# EAGLE design Teensy36 CAN Bus (EAGLE 9.6.1)
COMPANY_NAME: PROJECTMX5; PROJECT: TEENSY 3.6 DUAL CAN ADAPTER; SCH_REV: A
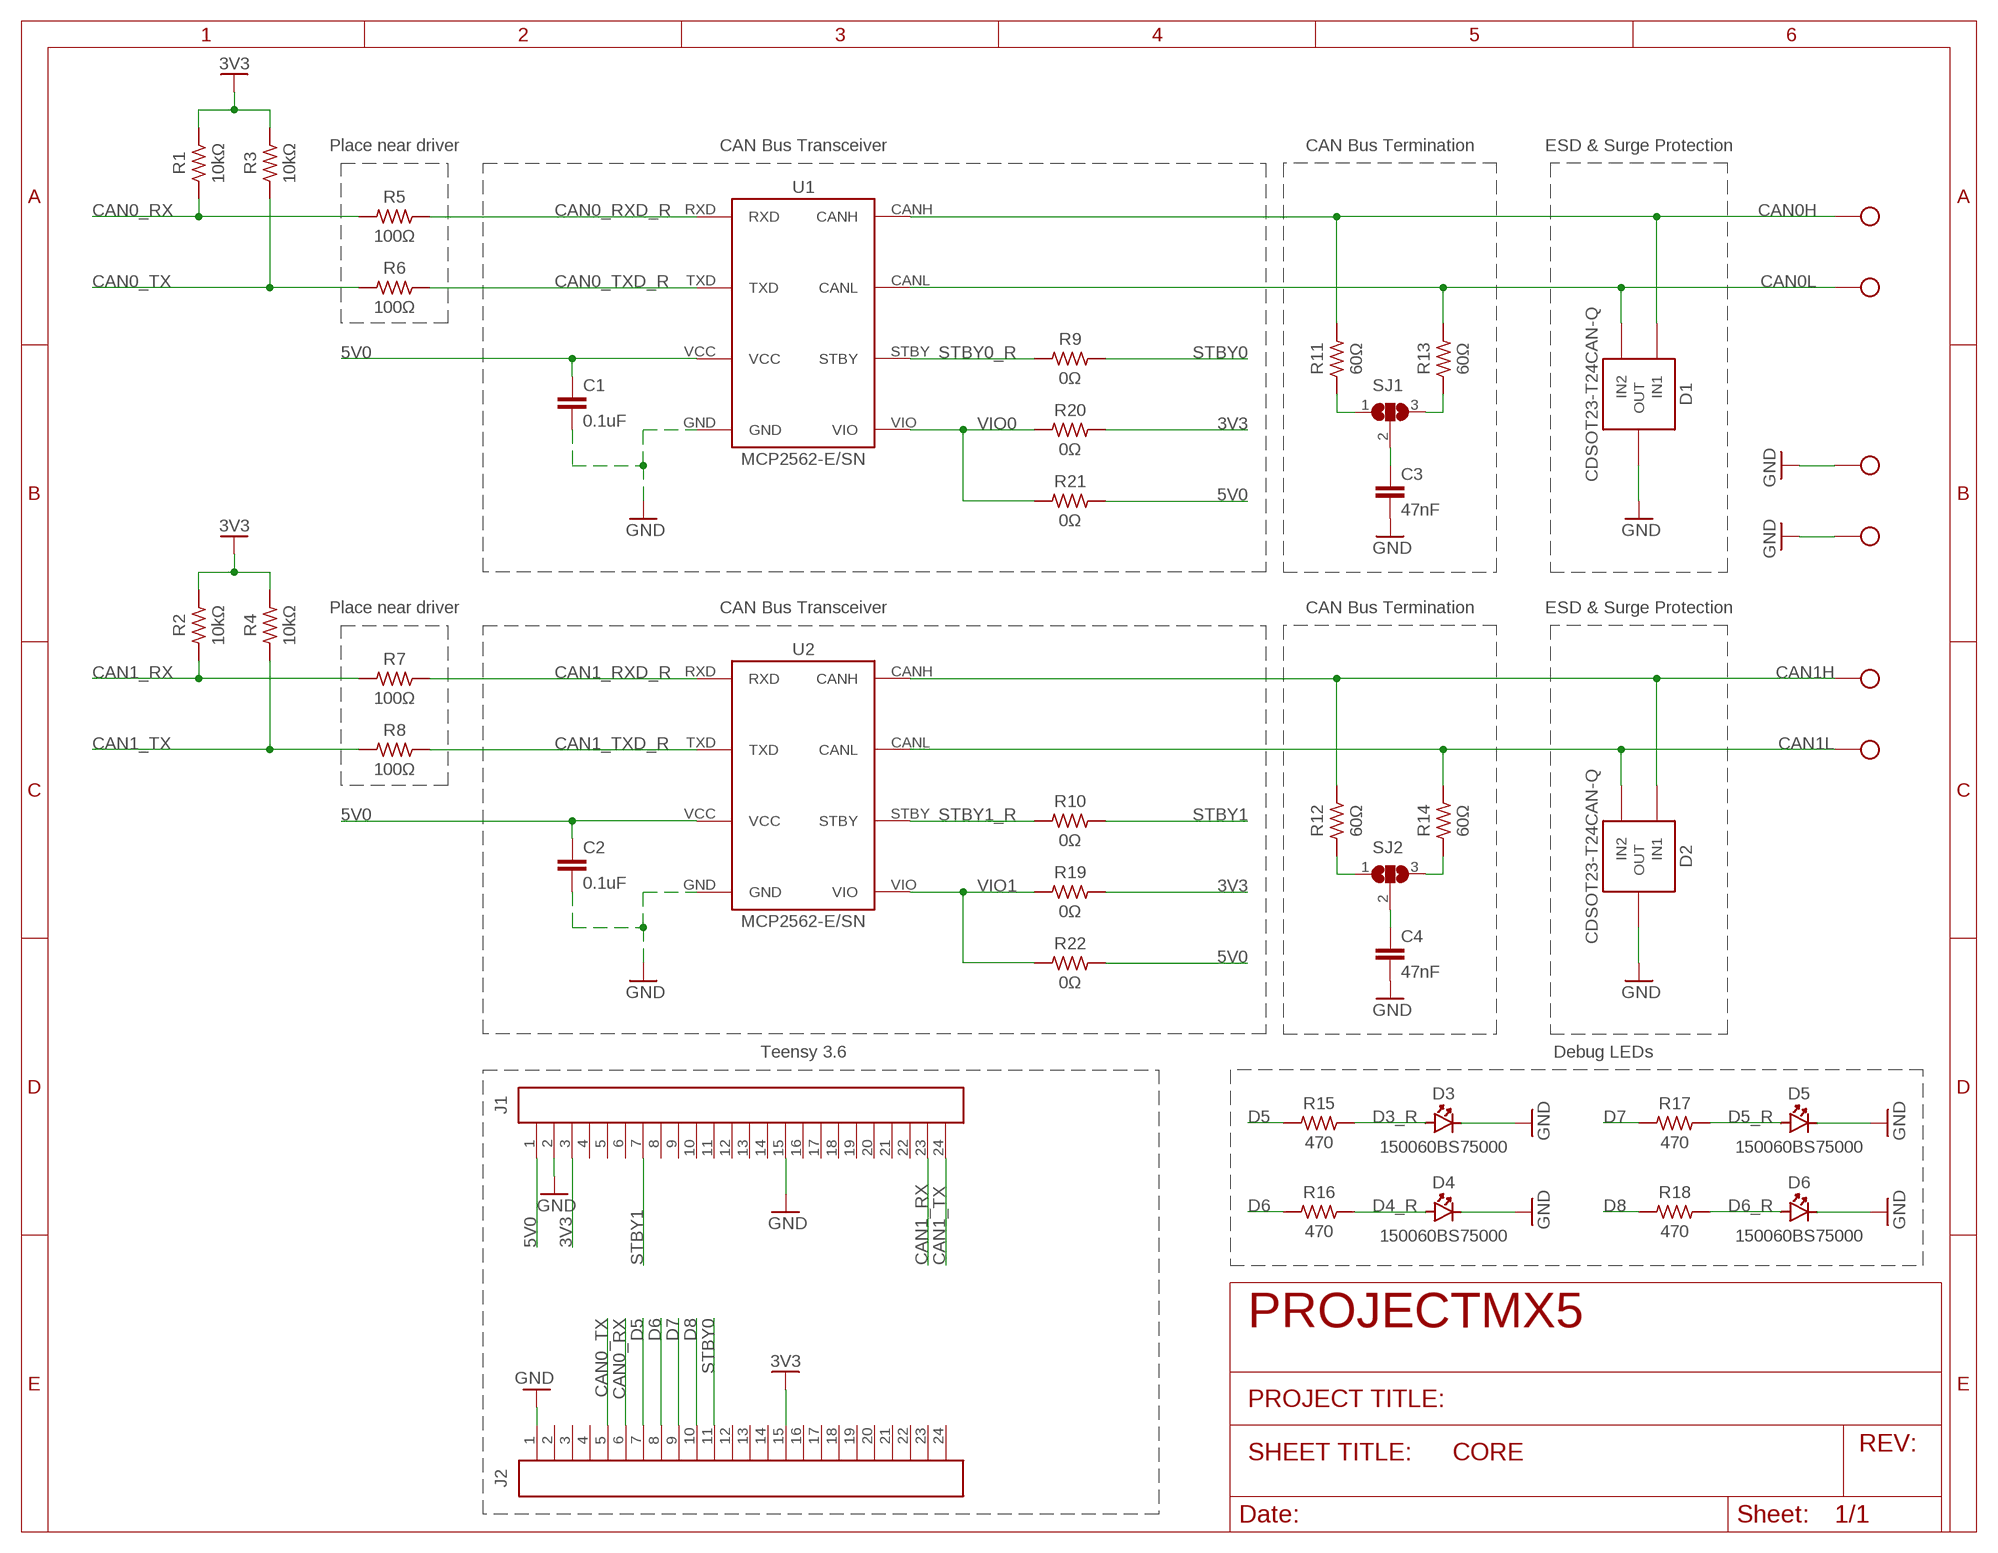
[diagram p0: schematic, sheet 1]

## Parts
C1  0.1uF  CAPACITOR0603  [CAP-0603]
C2  0.1uF  CAPACITOR0603  [CAP-0603]
C3  47nF  CAPACITOR0603  [CAP-0603]
C4  47nF  CAPACITOR0603  [CAP-0603]
D1  CDSOT23-T24CAN-Q  BOURNS_CDSOT23-T24CAN-Q  [BOURNS_CDSOT23-T24CAN-Q]
D2  CDSOT23-T24CAN-Q  BOURNS_CDSOT23-T24CAN-Q  [BOURNS_CDSOT23-T24CAN-Q]
D3  LED_BLUE_0603_WURTH  [WURTH_0603_LED]
D4  LED_BLUE_0603_WURTH  [WURTH_0603_LED]
D5  LED_BLUE_0603_WURTH  [WURTH_0603_LED]
D6  LED_BLUE_0603_WURTH  [WURTH_0603_LED]
J1  CONN_24PIN_VERT  [CONN_100MIL_24_PIN]
J2  CONN_24PIN_VERT  [CONN_100MIL_24_PIN]
J3  SOLDER_POINT  [SMD_PAD_100X200]
J4  SOLDER_POINT  [SMD_PAD_100X200]
J5  SOLDER_POINT  [SMD_PAD_100X200]
J6  SOLDER_POINT  [SMD_PAD_100X200]
J7  SOLDER_POINT  [SMD_PAD_100X200]
J8  SOLDER_POINT  [SMD_PAD_100X200]
R1  10kΩ  RESISTOR  [REST-0603]
R2  10kΩ  RESISTOR  [REST-0603]
R3  10kΩ  RESISTOR  [REST-0603]
R4  10kΩ  RESISTOR  [REST-0603]
R5  100Ω  RESISTOR  [REST-0603]
R6  100Ω  RESISTOR  [REST-0603]
R7  100Ω  RESISTOR  [REST-0603]
R8  100Ω  RESISTOR  [REST-0603]
R9  0Ω  RESISTOR  [REST-0603]
R10  0Ω  RESISTOR  [REST-0603]
R11  60Ω  RESISTOR  [REST-0603]
R12  60Ω  RESISTOR  [REST-0603]
R13  60Ω  RESISTOR  [REST-0603]
R14  60Ω  RESISTOR  [REST-0603]
R15  470  470OHM-0603-1%-1/10W  [REST-0603]
R16  470  470OHM-0603-1%-1/10W  [REST-0603]
R17  470  470OHM-0603-1%-1/10W  [REST-0603]
R18  470  470OHM-0603-1%-1/10W  [REST-0603]
R19  0Ω  RESISTOR  [REST-0603]
R20  0Ω  RESISTOR  [REST-0603]
R21  0Ω  RESISTOR  [REST-0603]
R22  0Ω  RESISTOR  [REST-0603]
SJ1  SJ2W  [SJ_2]
SJ2  SJ2W  [SJ_2]
U1  SN65HVD230DR  MICROCHIP_MCP2562-E/SN  [MICROCHIP_MCP2562]
U2  SN65HVD230DR  MICROCHIP_MCP2562-E/SN  [MICROCHIP_MCP2562]

## Nets
3V3: J1.3 J2.15 R1.2 R2.2 R3.2 R4.2 R19.2 R20.2
5V0: C1.1 C2.1 J1.1 R21.2 R22.2 U1.VCC U2.VCC
CAN0_CM: R13.1 SJ1.3
CAN0_RX: J2.6 R1.1 R5.1
CAN0_RXD_R: R5.2 U1.RXD
CAN0_TX: J2.5 R3.1 R6.1
CAN0_TXD_R: R6.2 U1.TXD
CAN0H: D1.IN2(IN1) J5.P$1(IN) R11.2 U1.CANH
CAN0L: D1.IN1(IN2) J6.P$1(IN) R13.2 U1.CANL
CAN1_RX: J1.23 R2.1 R7.1
CAN1_RXD_R: R7.2 U2.RXD
CAN1_TX: J1.24 R4.1 R8.1
CAN1_TXD_R: R8.2 U2.TXD
CAN1H: D2.IN2(IN1) J3.P$1(IN) R12.2 U2.CANH
CAN1L: D2.IN1(IN2) J4.P$1(IN) R14.2 U2.CANL
D3_R: D3.A R15.2
D4_R: D4.A R16.2
D5: J2.7 R15.1
D5_R: D5.A R17.2
D6: J2.8 R16.1
D6_R: D6.A R18.2
D7: J2.9 R17.1
D8: J2.10 R18.1
GND: C1.2 C2.2 C3.2 C4.2 D1.COMMON(OUT) D2.COMMON(OUT) D3.C D4.C D5.C D6.C J1.2 J1.15 J2.1 J7.P$1(IN) J8.P$1(IN) U1.GND U2.GND
N$1: R11.1 SJ1.1
N$2: C3.1 SJ1.2
N$3: R12.1 SJ2.1
N$4: R14.1 SJ2.3
N$5: C4.1 SJ2.2
STBY0: J2.11 R9.2
STBY0_R: R9.1 U1.STBY
STBY1: J1.7 R10.2
STBY1_R: R10.1 U2.STBY
VIO0: R20.1 R21.1 U1.VIO
VIO1: R19.1 R22.1 U2.VIO
Unconnected: J1.4 J1.5 J1.6 J1.8 J1.9 J1.10 J1.11 J1.12 J1.13 J1.14 J1.16 J1.17 J1.18 J1.19 J1.20 J1.21 J1.22 J2.2 J2.3 J2.4 J2.12 J2.13 J2.14 J2.16 J2.17 J2.18 J2.19 J2.20 J2.21 J2.22 J2.23 J2.24

## Notes on the sheet
- Place near driver | CAN Bus Transceiver | CAN Bus Termination | ESD & Surge Protection
- Place near driver | CAN Bus Transceiver | CAN Bus Termination | ESD & Surge Protection
- Teensy 3.6 | Debug LEDs

## Library data of the parts
C1-C4 = AlphaLibrary:CAPACITOR
D1 D2 = AlphaLibrary:BOURNS_CDSOT23-T24CAN-Q: ESD and surge protection for CAN transceivers
D3-D6 = AlphaLibrary:LED_BLUE_0603_WURTH: STANDARD LED, BLUE, 0603; MFG: WURTH ELEKTRONIK; MNT: SMD; PINS: 2; PKG: 0603; PN: 150060BS75000
J1 J2 = AlphaLibrary:CONN_24PIN_VERT: 24 Pin Header, 100mil
J3-J8 = KaiserEngineering:SOLDER_POINT
R1-R14 R19-R22 = AlphaLibrary:RESISTOR: Resistor
R15-R18 = resistors:470OHM: RESISTOR; MFG: PANASONIC; MNT: SMD; PINS: 2; PKG: 0603; PN: ERJ-3EKF4700V
SJ1 SJ2 = jumper:SJ2W: SMD solder JUMPER
U1 U2 = AlphaLibrary:MICROCHIP_MCP2562-E/SN: 3.3V CAN Bus TRANSCEIVER; MFG: MICROCHIP; MNT: SMD; PINS: 8; PKG: SOIC-8; PN: MCP2562-E/SN

## Board
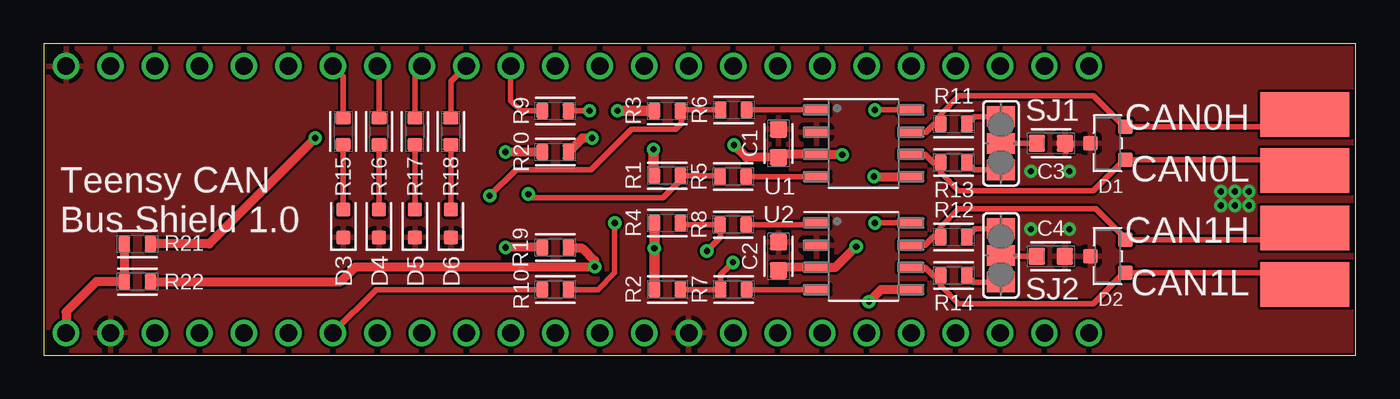
[diagram p1: board, top side]
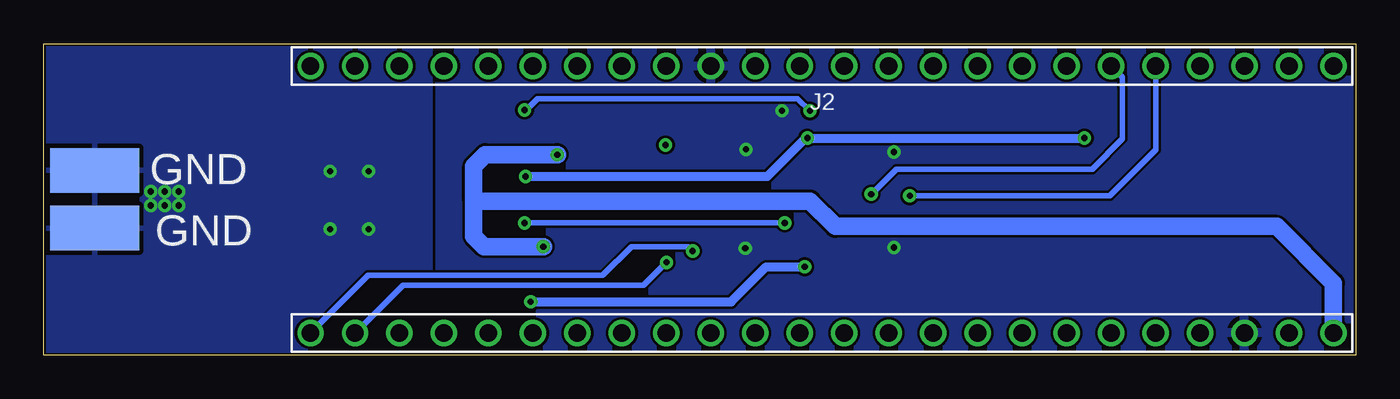
[diagram p2: board, bottom side, seen from below]

Size 74.93 x 17.78 mm. Coordinates in mm from the lower left corner, seen from the top.
Outline: 0,0 74.93,0 74.93,17.78 0,17.78 0,0
Copper layers (1*16): Top 0.035mm / dielectric 1.5mm / Bottom 0.035mm
Design rules "default *": minimum track width 6mil, minimum drill 0.35mm, track to track 6mil, track to pad 6mil, pad to pad 6mil, via to via 6mil, smd to smd 6mil, copper to edge 5mil, drill to drill 6mil, minimum pad ring 10mil, minimum via ring 8mil, stop-mask expansion 2mil, vias tented up to drill 100mil, thermal gap 10mil

### Footprints (pad centres in the part's own frame; a part is rotated, then mirrored left to right if it is on the bottom)
CAP-0603 = smd 0.95 x 1: 1 -0.8,0; 2 0.8,0
BOURNS_CDSOT23-T24CAN-Q = smd 0.85 x 0.85: COMMON 1,0; IN1 -1,0.95; IN2 -1,-0.95
WURTH_0603_LED = smd 0.8 x 0.8: A 0.8,0; C -0.8,0
CONN_100MIL_24_PIN = drill 1 pad 1.5: 1 -29.21,0; 2 -26.67,0; 3 -24.13,0; 4 -21.59,0; 5 -19.05,0; 6 -16.51,0; 7 -13.97,0; 8 -11.43,0; 9 -8.89,0; 10 -6.35,0; 11 -3.81,0; 12 -1.27,0; 13 1.27,0; 14 3.81,0; 15 6.35,0; 16 8.89,0; 17 11.43,0; 18 13.97,0; 19 16.51,0; 20 19.05,0; 21 21.59,0; 22 24.13,0; 23 26.67,0; 24 29.21,0
SMD_PAD_100X200 = smd 2.54 x 5.08: P$1 0,0
REST-0603 = smd 0.7 x 0.9: 1 -0.75,0; 2 0.75,0
SJ_2 = smd 1.168 x 1.6: 1 -1.524,0; 2 0,0; 3 1.524,0
MICROCHIP_MCP2562 = smd 1.55 x 0.6: CANH 2.7,0.635; CANL 2.7,-0.635; GND -2.7,0.635; RXD -2.7,-1.905; STBY 2.7,1.905; TXD -2.7,1.905; VCC -2.7,-0.635; VIO 2.7,-1.905

### Placement (x,y rotation side)
C1  41.97,12.1 90 top
C2  41.97,5.65 90 top
C3  57.52,12.1 0 top
C4  57.52,5.65 0 top
D1  60.77,12.1 180 top
D2  60.77,5.65 180 top
D3  17.1,7.53 90 top
D4  19.15,7.53 90 top
D5  21.2,7.53 90 top
D6  23.25,7.53 90 top
J1  30.48,1.27 180 bottom
J2  30.48,16.51 180 bottom
J3  72.02,7.25 90 top
J4  72.02,4.05 90 top
J5  72.02,13.75 90 top
J6  72.02,10.55 90 top
J7  72.02,10.55 90 bottom
J8  72.02,7.25 90 bottom
R1  35.62,10.25 180 top
R2  35.62,3.75 180 top
R3  35.62,13.95 180 top
R4  35.62,7.55 180 top
R5  39.37,10.2 0 top
R6  39.4,14 0 top
R7  39.4,3.75 0 top
R8  39.37,7.45 0 top
R9  29.22,13.95 180 top
R10  29.22,3.75 180 top
R11  51.97,13.2 180 top
R12  51.97,6.75 180 top
R13  51.97,11 180 top
R14  51.97,4.55 180 top
R15  17.1,12.78 270 top
R16  19.15,12.78 270 top
R17  21.2,12.78 270 top
R18  23.25,12.78 270 top
R19  29.22,6.15 180 top
R20  29.22,11.6 180 top
R21  5.35,6.35 180 top
R22  5.35,4.2 180 top
SJ1  54.67,12.1 270 top
SJ2  54.67,5.7 270 top
U1  46.82,12.1 0 top
U2  46.82,5.65 0 top

### Tracks (layer width: path | path; a pad name or v marks a point on that pad's centre or on a via)
3V3  (via drill 0.35)
  Top 0.5: R20.2 v26.37,11.6 | R19.2 v26.37,6.15
  Top 0.6: R3.2 v32.77,13.95 | R2.2 v34.87,6.1 R4.2 | R1.2 34.82,10.3 v34.82,11.75
  pour Bottom (rank 2): -0.73,21.25 80.08,21.25 80.08,-2.1 -0.73,-2.1
5V0  (via drill 0.35)
  Top 0.5: C2.1 42.12,5.01 U2.VCC 45.22,5.01 v46.4,6.2 | v45.6,11.45 45.59,11.46 U1.VCC 42.12,11.46 C1.1 40.12,11.3 v39.42,12 | R21.2 R22.2 3,4.2 1.27,2.47 J1.1
  Bottom 1: 50.37,8.8 50.37,10.8 49.72,11.45 v45.6,11.45 | 50.37,8.8 31.17,8.8 29.72,7.35 4.5,7.35 1.27,4.12 J1.1 | 50.37,8.8 50.37,6.79 49.78,6.2 v46.4,6.2
CAN0_CM
  Top 0.3: R13.1 53.14,10.58 SJ1.3
CAN0_RX  (via drill 0.35)
  Top 0.3: R5.1 38.6,10.25 R1.1 36.37,10 35.37,9 27.87,9 v27.67,9.2
  Bottom 0.3: v27.67,9.2 26.24,10.63 15.05,10.63 13.32,12.36 13.32,15.86 J2.6
CAN0_RXD_R
  Top 0.3: U1.RXD 44.09,10.2 R5.2
CAN0_TX  (via drill 0.35)
  Top 0.3: R3.1 36.42,14 | 36.42,14 R6.1 | 36.42,14 36.42,13.25 36.07,12.9 33.57,12.9 31.27,10.6 26.97,10.6 v25.47,9.1
  Bottom 0.3: v25.47,9.1 14.05,9.1 11.43,11.72 J2.5
CAN0_TXD_R
  Top 0.3: R6.2 44.09,14 U1.TXD
CAN0H
  Top 0.3: U1.CANH 50.38,12.73 50.85,13.2 R11.2 51.2,13.73 52.28,14.8 59.95,14.8 61.57,13.18 61.64,13.18 D1.IN2 71.43,13.05 J5.P$1
CAN0L
  Top 0.3: U1.CANL 50.34,11.46 50.8,11 R13.2 51.2,10.45 52.25,9.4 59.95,9.4 61.57,11.02 61.64,11.02 D1.IN1 71.51,11.15 J6.P$1
CAN1_RX  (via drill 0.35)
  Top 0.3: R2.1 R7.1 38.65,4.58 v39.37,5.3
  Bottom 0.3: v39.37,5.3 40.67,4 54.4,4 57.13,1.27 J1.23
CAN1_RXD_R
  Top 0.3: R7.2 44.09,3.75 U2.RXD
CAN1_TX  (via drill 0.35)
  Top 0.3: R4.1 36.47,7.45 R8.1 38.65,6.73 v37.87,5.95
  Bottom 0.3: v37.87,5.95 38.12,6.2 41.37,6.2 43.02,4.55 56.25,4.55 56.41,4.55 J1.24
CAN1_TXD_R
  Top 0.3: R8.2 43.99,7.45 U2.TXD
CAN1H
  Top 0.3: U2.CANH 50.34,6.29 50.8,6.75 R12.2 51.2,7.3 52.25,8.35 60.1,8.35 61.77,6.68 D2.IN2 71.47,6.6 J3.P$1
CAN1L
  Top 0.3: U2.CANL 50.34,5.01 50.8,4.55 R14.2 51.2,4 52.25,2.95 59.95,2.95 61.7,4.7 D2.IN1 71.47,4.7 J4.P$1
D3_R
  Top 0.3: R15.2 D3.A
D4_R
  Top 0.3: R16.2 D4.A
D5
  Top 0.3: R15.1 17.1,15.92 J2.7
D5_R
  Top 0.3: D5.A R17.2
D6
  Top 0.3: R16.1 19.15,16.41 J2.8
D6_R
  Top 0.3: R18.2 D6.A
D7
  Top 0.3: R17.1 21.2,16.12 J2.9
D8
  Top 0.3: R18.1 23.25,15.63 J2.10
GND  (via drill 0.35)
  Top 1: C3.2 58.37,12.05
  other vias: 67.22,9.35 68.02,9.35 68.82,9.35 67.22,8.55 68.02,8.55 68.82,8.55 56.37,7.2 58.57,7.2 56.37,10.5 58.57,10.5
  pour Top: -2.08,20.4 79.83,20.4 79.83,-2.2 -2.08,-2.2
  pour Bottom: 52.87,-0.25 52.87,18.1 75.47,18.1 75.47,-0.25
N$1
  Top 0.3: R11.1 53.14,13.62 SJ1.1
N$2
  Top 0.3: SJ1.2 C3.1
N$3
  Top 0.3: SJ2.1 53.19,7.22 R12.1
N$4
  Top 0.3: R14.1 53.09,4.18 SJ2.3
N$5
  Top 0.3: SJ2.2 54.72,5.65 C4.1
STBY0
  Top 0.3: R9.2 27.25,13.95 26.67,14.53 J2.11
STBY0_R  (via drill 0.35)
  Top 0.3: R9.1 v31.17,13.95 | v47.47,14 49.49,14 U1.STBY
  Bottom 0.3: v47.47,14 47.37,14 46.72,14.65 31.87,14.65 v31.17,13.95
STBY1
  Top 0.3: R10.2 18.99,3.75 J1.7
STBY1_R  (via drill 0.35)
  Top 0.3: v32.61,7.55 32.61,4.7 31.66,3.75 R10.1 | v47.47,7.55 49.49,7.55 U2.STBY
  Bottom 0.3: v47.47,7.55 v32.61,7.55
VIO0  (via drill 0.35)
  Top 0.5: v31.32,12.4 30.77,12.4 R20.1 | v47.42,10.2 U1.VIO | v15.5,12.4 9.45,6.35 R21.1
  Bottom 0.5: v47.42,10.2 33.62,10.2 31.42,12.4 v31.32,12.4 v15.5,12.4
VIO1  (via drill 0.35)
  Top 0.5: U2.VIO 47.81,3.75 v47.12,3.05 | R19.1 30.02,6.1 30.77,6.1 31.47,5.4 v31.47,5.05 17.8,5.05 16.95,4.2 R22.1
  Bottom 0.5: v47.12,3.05 35.67,3.05 33.67,5.05 v31.47,5.05

### Text on the board
tPlace: CAN0H | CAN0L | Teensy CAN / Bus Shield 1.0 | CAN1H | CAN1L
bPlace: GND | GND